# EAGLE design FSR Input MCP602 (EAGLE 9.6.2)
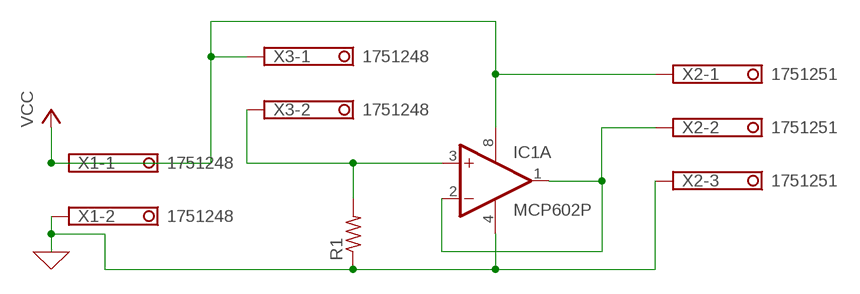
[diagram p0: schematic, sheet 1]

## Parts
IC1  MCP602P  [DIL08]
R1  R-US_0204/5  [0204/5]
X1  1751248  [1751248]
X2  1751251  [1751251]
X3  1751248  [1751248]

## Nets
0: IC1.4(P:V-) R1.1 X1.2 X2.3 ; supply symbol labelled GND
N$1: IC1.3(A:+IN) R1.2 X3.2
N$2: IC1.1(A:OUT) IC1.2(A:-IN) X2.2
VCC: IC1.8(P:V+) X1.1 X2.1 X3.1
Unconnected: IC1.5(B:+IN) IC1.6(B:-IN) IC1.7(B:OUT)

## Library data of the parts
IC1 = linear:MCP602: Single Op Amp 2.7V to 6.0V Single Supply CMOS Source: http://ww1.microchip.com/downloads/en/DeviceDoc/21314g.pdf
R1 = rcl:R-US_: RESISTOR, American symbol; SPICEPREFIX: R
X1 X3 = con-phoenix-350:1751248: MKDS 1/ 2-3,5 Printklemme Nennstrom: 10 A Bemessungsspannung: 160 V Raster: 3,5 mm Polzahl: 2 Montageart: Löten Anschlussart: Schraubanschluss Anschlussrichtung vom Leiter zur Platine: 0° Source: http://eshop.phoenixcontact.com .. 1751248.pdf; OC_FARNELL: unknown; OC_NEWARK: unknown
X2 = con-phoenix-350:1751251: MKDS 1/ 3-3,5 Printklemme Nennstrom: 10 A Bemessungsspannung: 160 V Raster: 3,5 mm Polzahl: 3 Montageart: Löten Anschlussart: Schraubanschluss Anschlussrichtung vom Leiter zur Platine: 0° Source: http://eshop.phoenixcontact.com .. 1751251.pdf; OC_FARNELL: unknown; OC_NEWARK: unknown

## Board
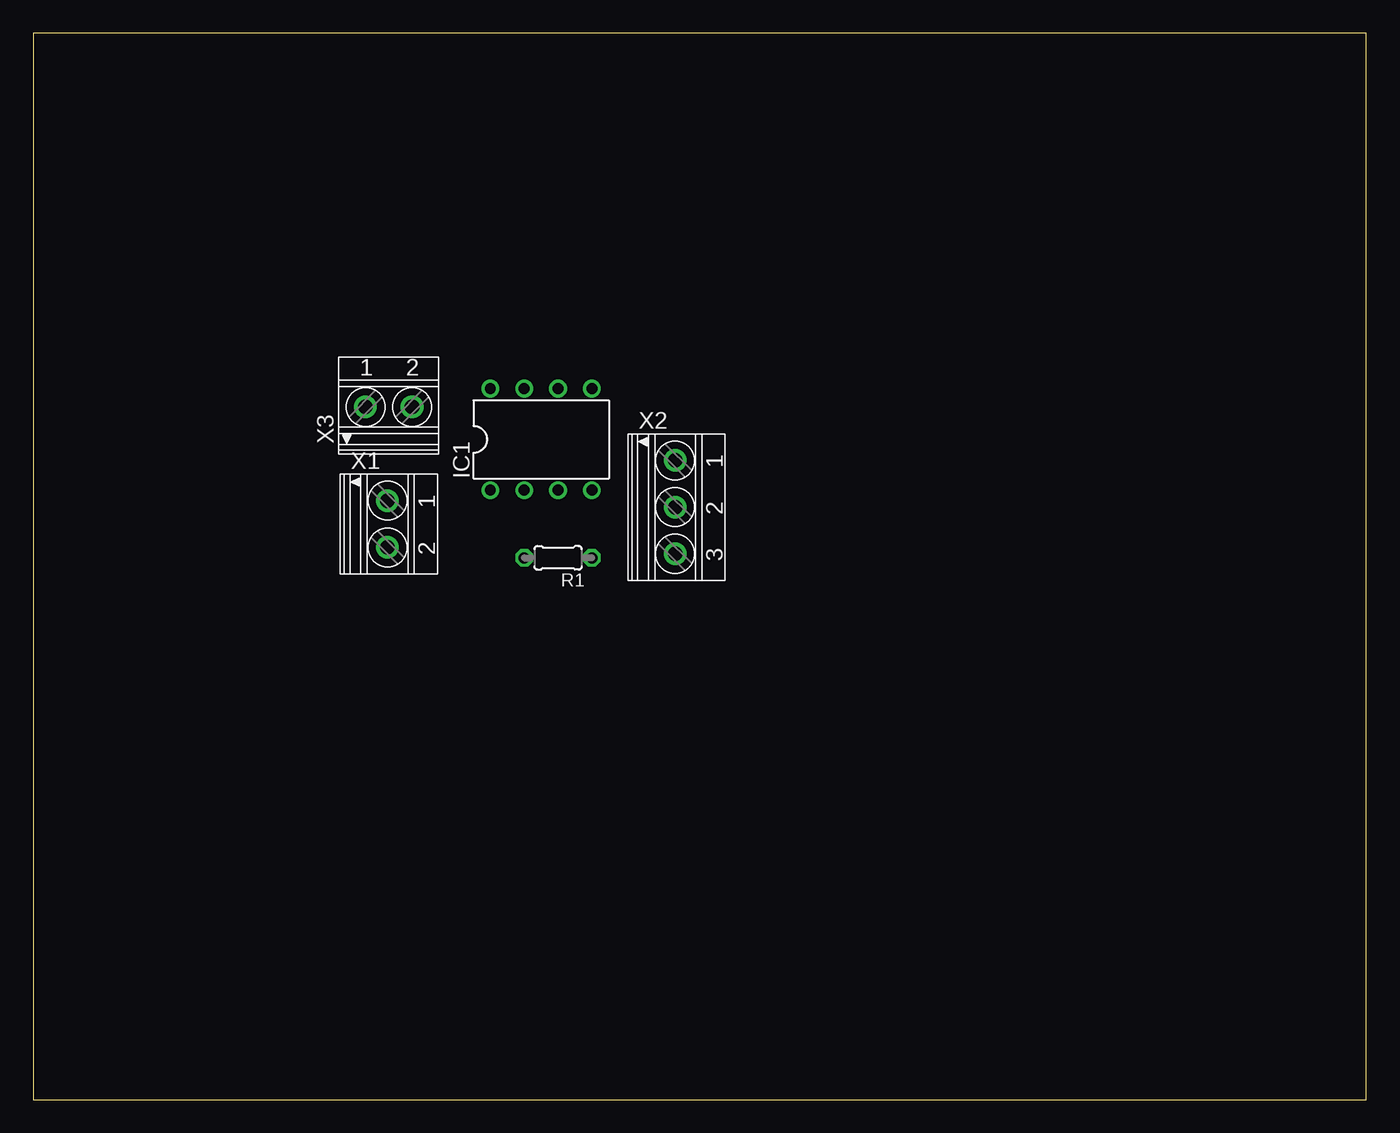
[diagram p1: board, top side]
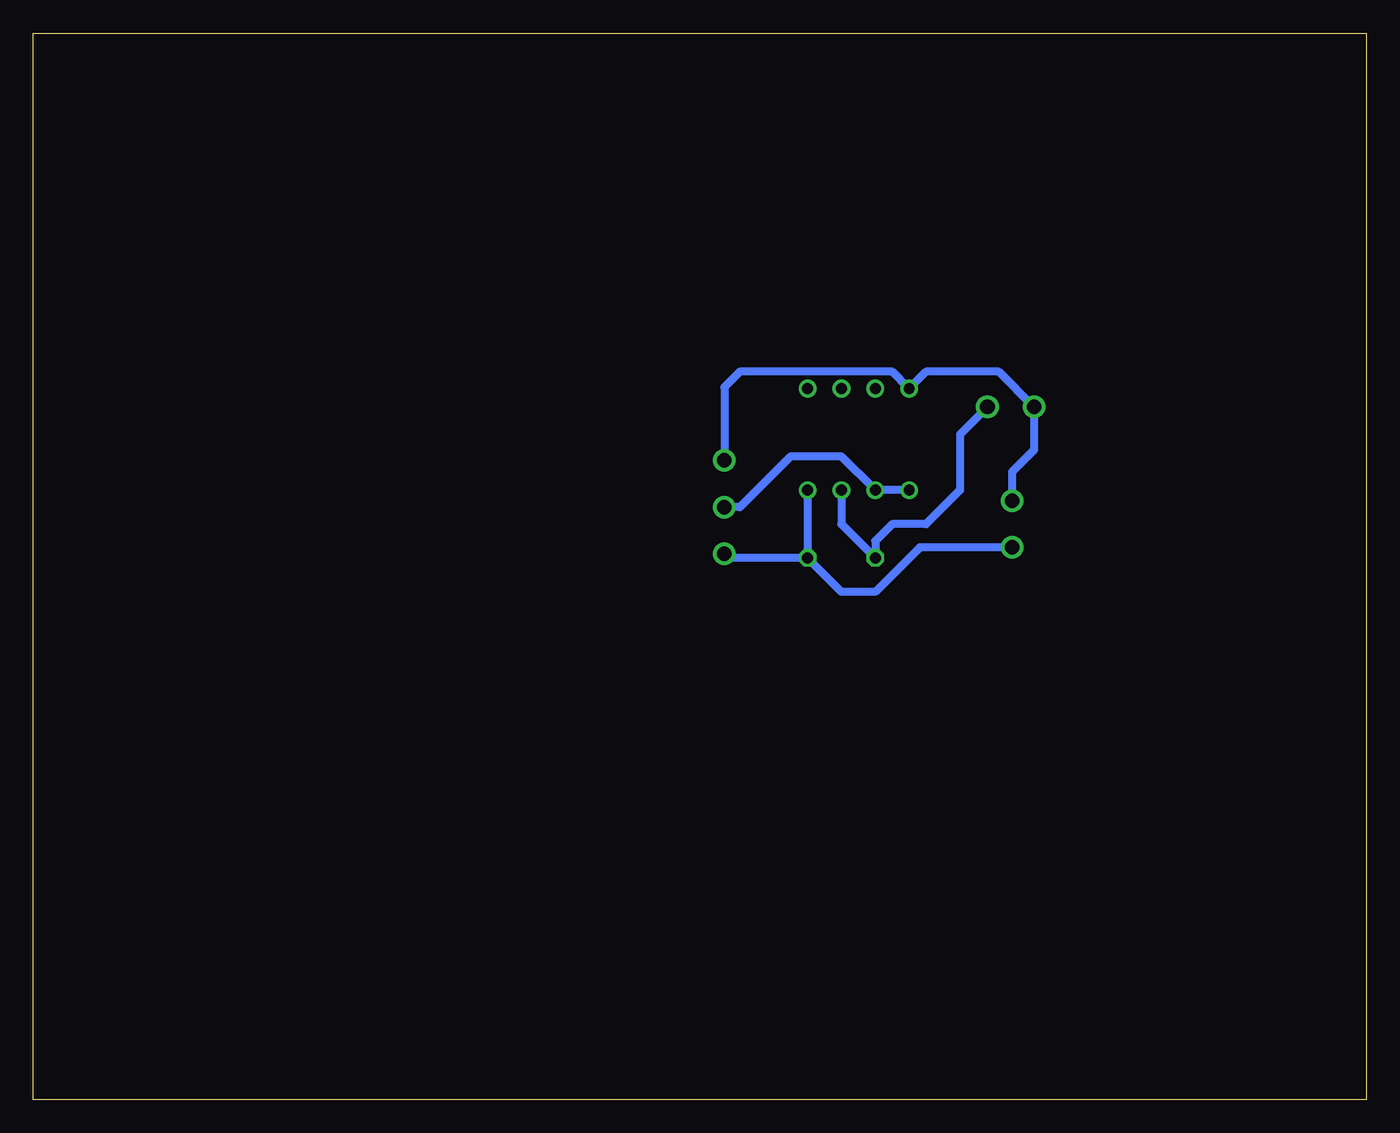
[diagram p2: board, bottom side, seen from below]

Size 100 x 80 mm. Coordinates in mm from the lower left corner, seen from the top.
Outline: 0,0 100,0 100,80 0,80 0,0
Copper layers (1*16): Top 0.035mm / dielectric 1.5mm / Bottom 0.035mm
Design rules "default": minimum track width 6mil, minimum drill 0.35mm, track to track 6mil, track to pad 6mil, pad to pad 6mil, via to via 6mil, smd to smd 6mil, copper to edge 40mil, drill to drill 6mil, minimum pad ring 10mil, minimum via ring 8mil, stop-mask expansion 4mil, vias tented up to drill 0mil, thermal gap 10mil

### Footprints (pad centres in the part's own frame; a part is rotated, then mirrored left to right if it is on the bottom)
DIL08 = drill 0.813 pad 1.27: 1 -3.81,-3.81; 2 -1.27,-3.81; 3 1.27,-3.81; 4 3.81,-3.81; 5 3.81,3.81; 6 1.27,3.81; 7 -1.27,3.81; 8 -3.81,3.81
0204/5 = drill 0.813 octagon: 1 -2.54,0; 2 2.54,0
1751248 = drill 1.1 pad 1.7: 1 -1.75,-0.1; 2 1.75,-0.1
1751251 = drill 1.1 pad 1.7: 1 -3.5,-0.1; 2 0,-0.1; 3 3.5,-0.1

### Placement (x,y rotation side)
IC1  38.1,49.53 0 top
R1  39.37,40.64 180 top
X1  26.67,43.18 270 top
X2  48.26,44.45 270 top
X3  26.67,52.07 0 top

### Tracks (layer width: path | path; a pad name or v marks a point on that pad's centre or on a via)
0
  Bottom 0.61: X1.2 33.5,41.43 36.83,38.1 39.37,38.1 R1.1 | R1.1 47.85,40.64 X2.3 | IC1.4 R1.1
N$1
  Bottom 0.61: X3.2 30.48,49.91 30.48,45.72 33.02,43.18 35.56,43.18 36.83,41.91 R1.2 39.37,43.18 IC1.3
N$2
  Bottom 0.61: IC1.1 IC1.2 39.37,48.26 43.18,48.26 46.99,44.45 X2.2
VCC
  Bottom 0.61: X2.1 48.16,53.44 46.99,54.61 35.56,54.61 IC1.8 33.02,54.61 27.56,54.61 X3.1 24.92,48.74 26.57,47.09 X1.1